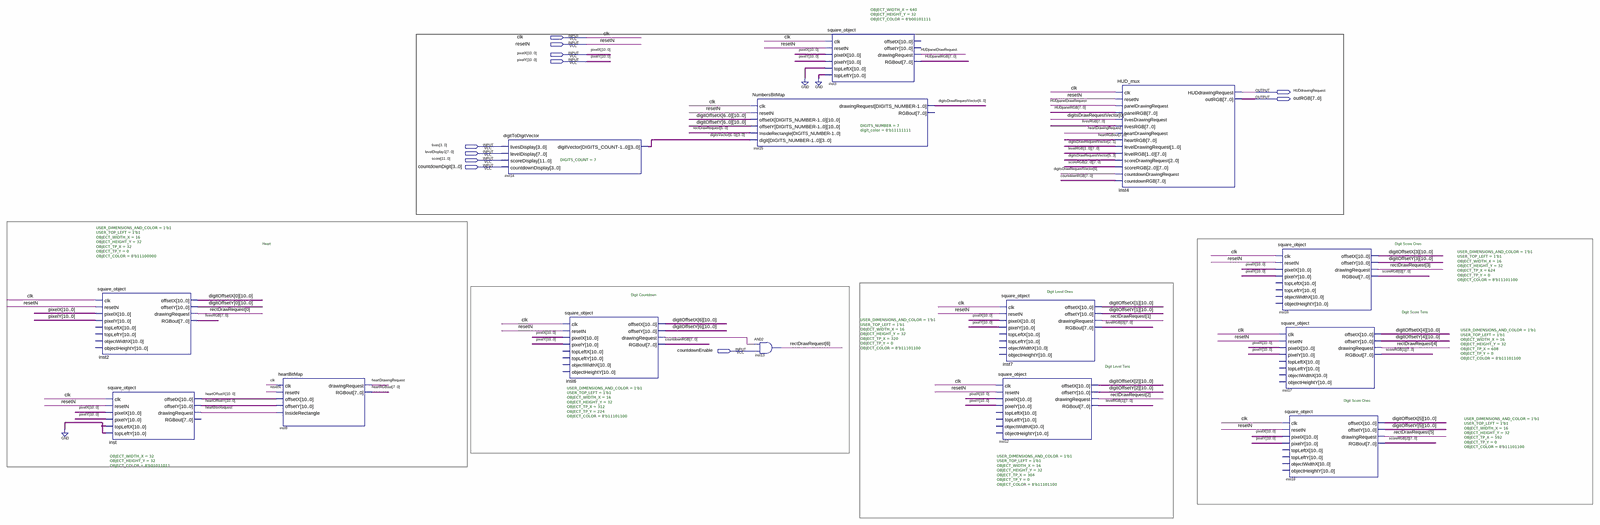
[diagram p0: schematic sheet, whole]
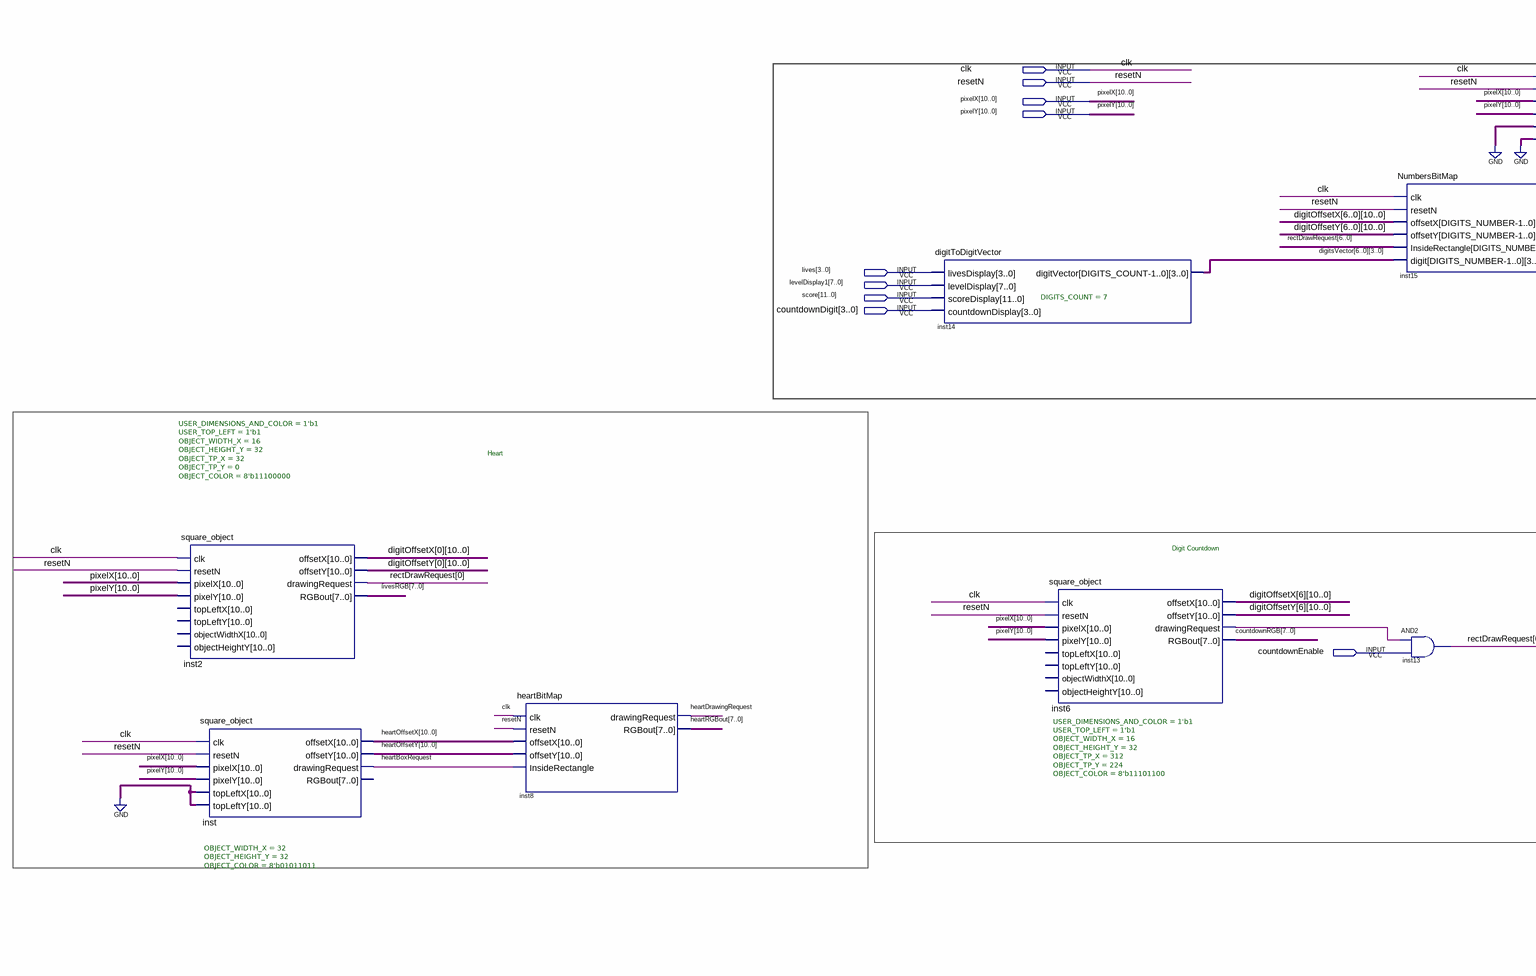
[diagram p1: schematic sheet, left part]
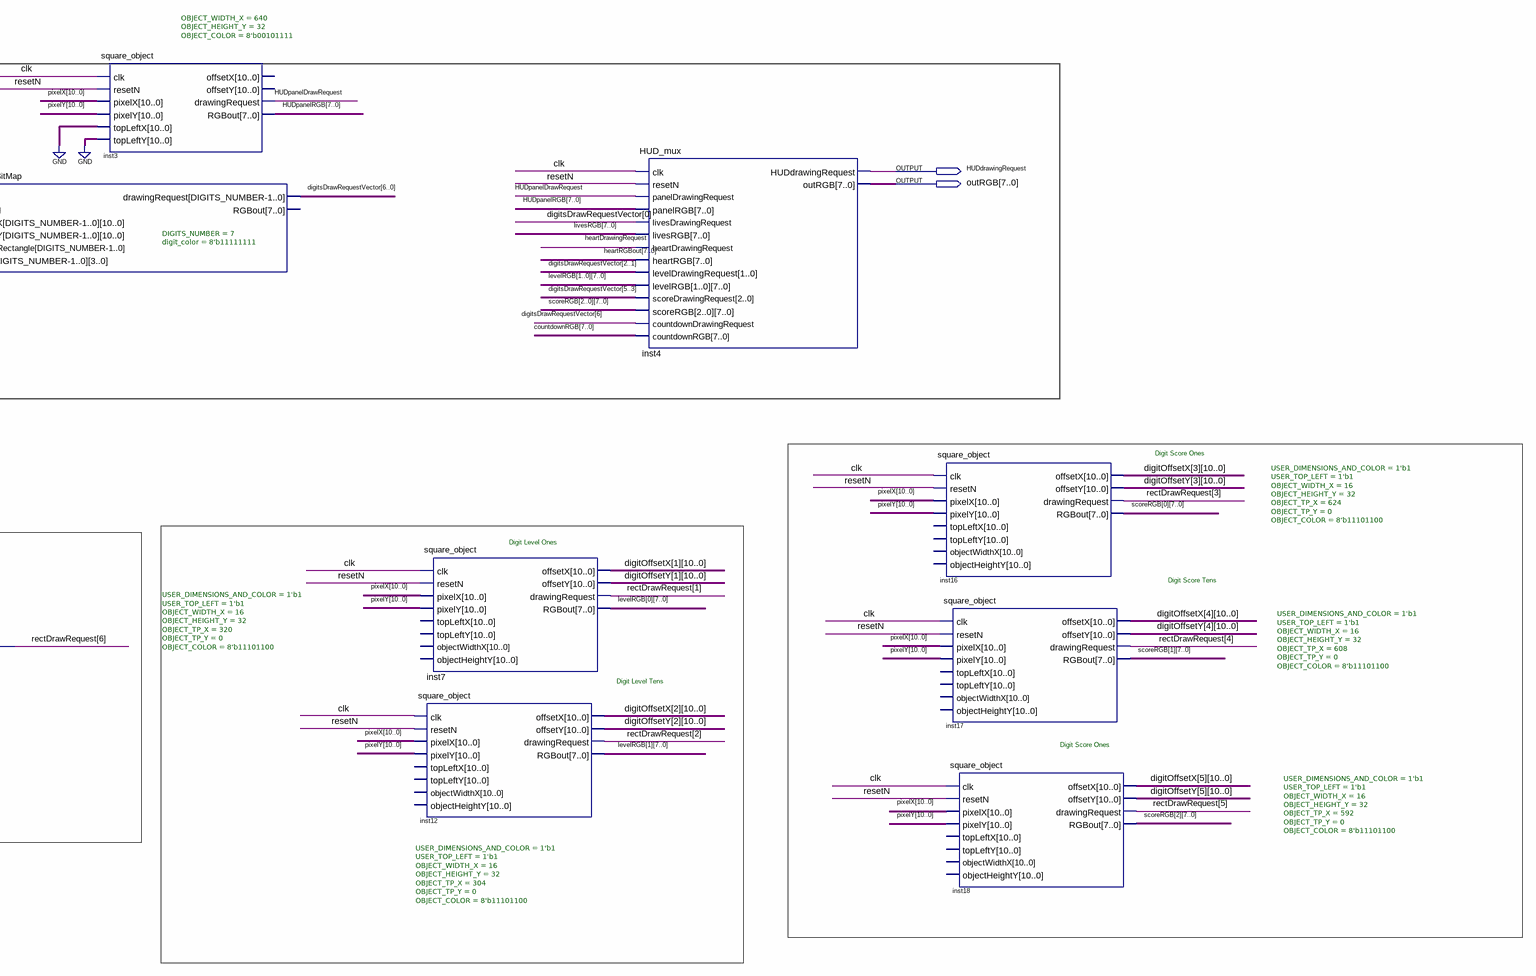
[diagram p2: schematic sheet, right part]
// Quartus schematic HUD_TOP.bdf as structural Verilog: 14 symbols, 11 pins
module HUD_TOP (
  input  clk,
  input  resetN,
  input  [10:0] pixelX,
  input  [10:0] pixelY,
  input  [3:0] lives,
  input  [7:0] levelDisplay1,
  input  [11:0] score,
  input  [3:0] countdownDigit,
  input  countdownEnable,
  output HUDdrawingRequest,
  output [7:0] outRGB
);

  wire heartBoxRequest, heartDrawingRequest, HUDpanelDrawRequest, inst6_drawingrequest;
  wire [3:0] digitsVector_0, digitsVector_1, digitsVector_2, digitsVector_3, digitsVector_4, digitsVector_5,
       digitsVector_6;
  wire [6:0] digitsDrawRequestVector, rectDrawRequest;
  wire [7:0] countdownRGB, heartRGBout, HUDpanelRGB, levelRGB_0, levelRGB_1, livesRGB, scoreRGB_0,
       scoreRGB_1, scoreRGB_2;
  wire [10:0] digitOffsetX_0, digitOffsetX_1, digitOffsetX_2, digitOffsetX_3, digitOffsetX_4, digitOffsetX_5,
       digitOffsetX_6, digitOffsetY_0, digitOffsetY_1, digitOffsetY_2, digitOffsetY_3, digitOffsetY_4,
       digitOffsetY_5, digitOffsetY_6, heartOffsetX, heartOffsetY;

  square_object #(.USER_DIMENSIONS_AND_COLOR(1'b1), .USER_TOP_LEFT(1'b1), .OBJECT_WIDTH_X(16), .OBJECT_HEIGHT_Y(32), .OBJECT_TP_X(32), .OBJECT_TP_Y(0), .OBJECT_COLOR(8'b11100000)) inst2 (
    .clk(clk), .resetN(resetN), .pixelX(pixelX), .pixelY(pixelY), .offsetX(digitOffsetX_0),
    .offsetY(digitOffsetY_0), .drawingRequest(rectDrawRequest[0]), .RGBout(livesRGB));  // open: topLeftX, topLeftY, objectWidthX, objectHeightY
  square_object #(.OBJECT_WIDTH_X(32), .OBJECT_HEIGHT_Y(32), .OBJECT_COLOR(8'b01011011)) inst (
    .clk(clk), .resetN(resetN), .pixelX(pixelX), .pixelY(pixelY), .topLeftX({11{1'b0}}),
    .topLeftY({11{1'b0}}), .offsetX(heartOffsetX), .offsetY(heartOffsetY), .drawingRequest(heartBoxRequest));  // open: RGBout
  heartBitMap inst8 (
    .clk(clk), .resetN(resetN), .offsetX(heartOffsetX), .offsetY(heartOffsetY),
    .InsideRectangle(heartBoxRequest), .drawingRequest(heartDrawingRequest), .RGBout(heartRGBout));
  digitToDigitVector #(.DIGITS_COUNT(7)) inst14 (
    .livesDisplay(lives), .levelDisplay(levelDisplay1), .scoreDisplay(score),
    .countdownDisplay(countdownDigit),
    .digitVector({digitsVector_6, digitsVector_5, digitsVector_4, digitsVector_3, digitsVector_2, digitsVector_1, digitsVector_0}));
  square_object #(.USER_DIMENSIONS_AND_COLOR(1'b1), .USER_TOP_LEFT(1'b1), .OBJECT_WIDTH_X(16), .OBJECT_HEIGHT_Y(32), .OBJECT_TP_X(312), .OBJECT_TP_Y(224), .OBJECT_COLOR(8'b11101100)) inst6 (
    .clk(clk), .resetN(resetN), .pixelX(pixelX), .pixelY(pixelY), .offsetX(digitOffsetX_6),
    .offsetY(digitOffsetY_6), .drawingRequest(inst6_drawingrequest), .RGBout(countdownRGB));  // open: topLeftX, topLeftY, objectWidthX, objectHeightY
  NumbersBitMap #(.DIGITS_NUMBER(7), .digit_color(8'b11111111)) inst15 (
    .clk(clk), .resetN(resetN),
    .offsetX({digitOffsetX_6, digitOffsetX_5, digitOffsetX_4, digitOffsetX_3, digitOffsetX_2, digitOffsetX_1, digitOffsetX_0}),
    .offsetY({digitOffsetY_6, digitOffsetY_5, digitOffsetY_4, digitOffsetY_3, digitOffsetY_2, digitOffsetY_1, digitOffsetY_0}),
    .InsideRectangle(rectDrawRequest),
    .digit({digitsVector_6, digitsVector_5, digitsVector_4, digitsVector_3, digitsVector_2, digitsVector_1, digitsVector_0}),
    .drawingRequest(digitsDrawRequestVector));  // open: RGBout
  and inst13 (rectDrawRequest[6], inst6_drawingrequest, countdownEnable);
  square_object #(.OBJECT_WIDTH_X(640), .OBJECT_HEIGHT_Y(32), .OBJECT_COLOR(8'b00101111)) inst3 (
    .clk(clk), .resetN(resetN), .pixelX(pixelX), .pixelY(pixelY), .topLeftX({11{1'b0}}),
    .topLeftY({11{1'b0}}), .drawingRequest(HUDpanelDrawRequest), .RGBout(HUDpanelRGB));  // open: offsetX, offsetY
  square_object #(.USER_DIMENSIONS_AND_COLOR(1'b1), .USER_TOP_LEFT(1'b1), .OBJECT_WIDTH_X(16), .OBJECT_HEIGHT_Y(32), .OBJECT_TP_X(320), .OBJECT_TP_Y(0), .OBJECT_COLOR(8'b11101100)) inst7 (
    .clk(clk), .resetN(resetN), .pixelX(pixelX), .pixelY(pixelY), .offsetX(digitOffsetX_1),
    .offsetY(digitOffsetY_1), .drawingRequest(rectDrawRequest[1]), .RGBout(levelRGB_0));  // open: topLeftX, topLeftY, objectWidthX, objectHeightY
  square_object #(.USER_DIMENSIONS_AND_COLOR(1'b1), .USER_TOP_LEFT(1'b1), .OBJECT_WIDTH_X(16), .OBJECT_HEIGHT_Y(32), .OBJECT_TP_X(304), .OBJECT_TP_Y(0), .OBJECT_COLOR(8'b11101100)) inst12 (
    .clk(clk), .resetN(resetN), .pixelX(pixelX), .pixelY(pixelY), .offsetX(digitOffsetX_2),
    .offsetY(digitOffsetY_2), .drawingRequest(rectDrawRequest[2]), .RGBout(levelRGB_1));  // open: topLeftX, topLeftY, objectWidthX, objectHeightY
  HUD_mux inst4 (
    .clk(clk), .resetN(resetN), .panelDrawingRequest(HUDpanelDrawRequest), .panelRGB(HUDpanelRGB),
    .livesDrawingRequest(digitsDrawRequestVector[0]), .livesRGB(livesRGB),
    .heartDrawingRequest(heartDrawingRequest), .heartRGB(heartRGBout),
    .levelDrawingRequest(digitsDrawRequestVector[2:1]), .levelRGB({levelRGB_1, levelRGB_0}),
    .scoreDrawingRequest(digitsDrawRequestVector[5:3]), .scoreRGB({scoreRGB_2, scoreRGB_1, scoreRGB_0}),
    .countdownDrawingRequest(digitsDrawRequestVector[6]), .countdownRGB(countdownRGB),
    .HUDdrawingRequest(HUDdrawingRequest), .outRGB(outRGB));
  square_object #(.USER_DIMENSIONS_AND_COLOR(1'b1), .USER_TOP_LEFT(1'b1), .OBJECT_WIDTH_X(16), .OBJECT_HEIGHT_Y(32), .OBJECT_TP_X(624), .OBJECT_TP_Y(0), .OBJECT_COLOR(8'b11101100)) inst16 (
    .clk(clk), .resetN(resetN), .pixelX(pixelX), .pixelY(pixelY), .offsetX(digitOffsetX_3),
    .offsetY(digitOffsetY_3), .drawingRequest(rectDrawRequest[3]), .RGBout(scoreRGB_0));  // open: topLeftX, topLeftY, objectWidthX, objectHeightY
  square_object #(.USER_DIMENSIONS_AND_COLOR(1'b1), .USER_TOP_LEFT(1'b1), .OBJECT_WIDTH_X(16), .OBJECT_HEIGHT_Y(32), .OBJECT_TP_X(608), .OBJECT_TP_Y(0), .OBJECT_COLOR(8'b11101100)) inst17 (
    .clk(clk), .resetN(resetN), .pixelX(pixelX), .pixelY(pixelY), .offsetX(digitOffsetX_4),
    .offsetY(digitOffsetY_4), .drawingRequest(rectDrawRequest[4]), .RGBout(scoreRGB_1));  // open: topLeftX, topLeftY, objectWidthX, objectHeightY
  square_object #(.USER_DIMENSIONS_AND_COLOR(1'b1), .USER_TOP_LEFT(1'b1), .OBJECT_WIDTH_X(16), .OBJECT_HEIGHT_Y(32), .OBJECT_TP_X(592), .OBJECT_TP_Y(0), .OBJECT_COLOR(8'b11101100)) inst18 (
    .clk(clk), .resetN(resetN), .pixelX(pixelX), .pixelY(pixelY), .offsetX(digitOffsetX_5),
    .offsetY(digitOffsetY_5), .drawingRequest(rectDrawRequest[5]), .RGBout(scoreRGB_2));  // open: topLeftX, topLeftY, objectWidthX, objectHeightY

  // Notes on the sheet:
  //   Heart
  //   Digit Score Ones
  //   Digit Level Ones
  //   Digit Countdown
  //   Digit Score Tens
  //   Digit Level Tens
  //   Digit Score Ones
endmodule
